# Altium project Project1_TPSM84824.PrjPcb
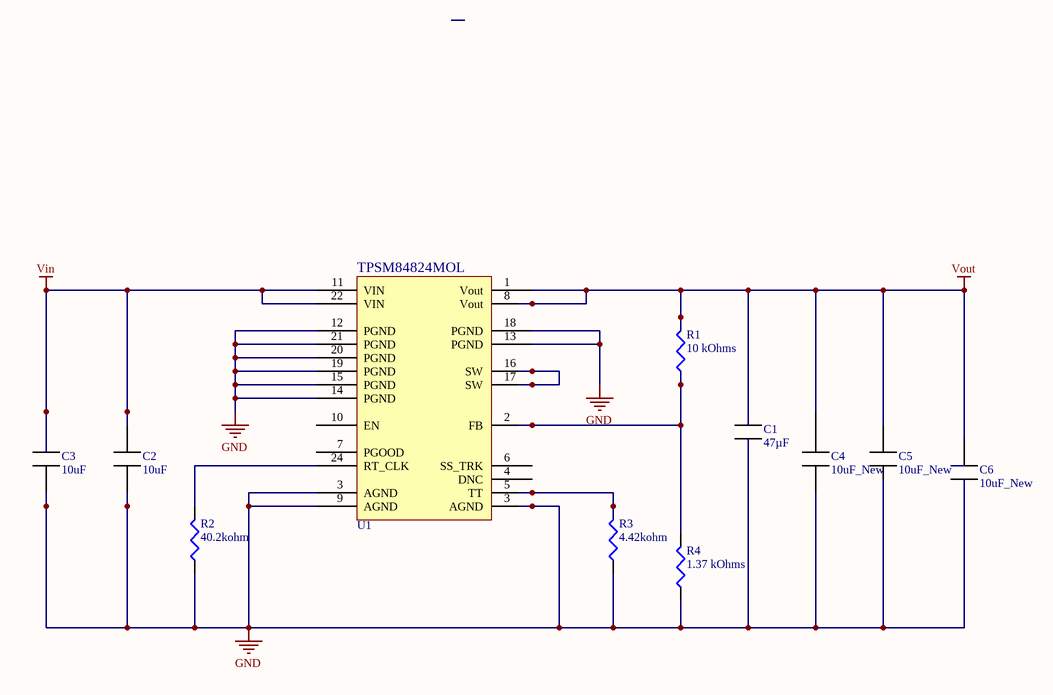
[diagram p0: TPSM84824MOL.SchDoc]
1 sheet, 11 parts. Net scope: global (net labels, ports and power ports of the same name join across sheets).
Board file: TPSM84824_PCB.PcbDoc

## Sheet TPSM84824MOL.SchDoc
size A

### Parts
C1  47µF  [C/R0805]
C2  10uF  [C/R0805]
C3  10uF  [C/R0805]
C4  10uF_New  [CAPPM7343X310N]
C5  10uF_New  [CAPPM7343X310N]
C6  10uF_New  [CAPPM7343X310N]
R1  10 kOhms  [C/R0805]
R2  40.2kohm  [C/R0805]
R3  4.42kohm  [C/R0805]
R4  1.37 kOhms  [C/R0805]
U1  TPSM84824MOL  [TPSM84424MOLR]  (value not drawn)

### Nets
GND: C1.3 C2.1 C3.1 C6.3 R2.1 R3.1 R4.1 U1.3(AGND) U1.9(AGND) U1.12(PGND) U1.13(PGND) U1.14(PGND) U1.15(PGND) U1.18(PGND) U1.19(PGND) U1.20(PGND) U1.21(PGND)
Vin: C2.2 C3.2 U1.11(VIN) U1.22(VIN)
Vout: C1.4 R1.2 U1.1(Vout) U1.8(Vout)
NetR1_1: R1.1 R4.2 U1.2(FB)
NetR2_2: R2.2 U1.24(RT_CLK)
NetR3_2: R3.2 U1.5(TT)
NetU1_16: U1.16(SW) U1.17(SW)

Not connected (* = marked no-connect by the designer): C4 3 4; C5 3 4; C6 4; U1 4(DNC) 6(SS_TRK) 7(PGOOD) 10(EN)

### Library data of the parts
C1 = GRM21BR60J476ME15K: 47µF 6.3V Ceramic Capacitor X5R 0805 (2012 Metric) 0.079" L x 0.049" W (2.00mm x 1.25mm); Manufacturer: Murata; Categories: Capacitors; Tolerance: ±20%; Supplier 1: Digi-Key; Manufacturer Part Number: GRM21BR60J476ME15K; Stock 1: 16872; Pricing 1: 1=0.48, 10=0.339, 100=0.2236, 500=0.1656, 1000=0.1408, 2500=0.1325, 5000=0.1242 (USD); Series: GRM; Packaging: Tape & Reel (TR); Part Status: Not For New Designs; Capacitance: 47µF; Voltage - Rated: 6.3V; Temperature Coefficient: X5R; Operating Temperature: -55°C ~ 85°C; Features: -; Ratings: -; Applications: General Purpose; Mounting Type: Surface Mount, MLCC; Package / Case: 0805 (2012 Metric); Size / Dimension: 0.079 L x 0.049 W (2.00mm x 1.25mm); Height - Seated (Max): -; Thickness (Max): 0.057 (1.45mm); Lead Spacing: -; Lead Style: -; ComponentLink1URL: http://www.mouser.com/ds/2/281/c02e-2905.pdf?src-supplier=Mouser; ComponentLink1Description: http://www.mouser.com/ds/2/281/c02e-2905.pdf?src-supplier=Mouser; ComponentLink2URL: https://search.murata.co.jp/Ceramy/image/img/A01X/G101/ENG/GRM21BR60J476ME15-01.pdf?src-supplier=Digi-Key; ComponentLink2Description: https://search.murata.co.jp/Ceramy/image/img/A01X/G101/ENG/GRM21BR60J476ME15-01.pdf?src-supplier=Digi-Key
C2 C3 = C0805C106K8PACTU: CAP CER 10UF 10V X5R 0805; Manufacturer: KEMET; Voltage: 10 Vdc; Tolerance: 10 %; Product Length: 2 mm; Product Height: 1.25 mm; Supplier 1: Digi-Key; Manufacturer Part Number: C0805C106K8PACTU; Stock 1: 872414; Pricing 1: 1=0.16, 10=0.117, 100=0.055, 500=0.0386, 1000=0.0319 (USD); Package/Case: 0805; Mounting: Surface Mount; Capacitance Value: 10 uF; Dielectric: X5R; Operating Temperature: -55 to 85 °C; Construction: Flat; Category: Capacitor Ceramic Multilayer; ComponentLink1URL: http://www.farnell.com/datasheets/2739827.pdf?src-supplier=Element14; ComponentLink1Description: http://www.farnell.com/datasheets/2739827.pdf?src-supplier=Element14; ComponentLink2URL: http://www.farnell.com/datasheets/40889.pdf?src-supplier=Element14; ComponentLink2Description: http://www.farnell.com/datasheets/40889.pdf?src-supplier=Element14
C4-C6 = T495D106M035ATE125: CAP TANT 10UF 35V 20% 2917; Manufacturer: KEMET; Product Range: KEMET - T495 Series; Capacitance: 10µF; Capacitor Case Style: 2917 ^7343 Metric]; ESR: 0.125ohm; Supplier 1: Digi-Key; Manufacturer Part Number: T495D106M035ATE125; Stock 1: 5675; Pricing 1: 1=1.79, 10=1.449, 100=1.1066 (USD); Packaging: Full Reel; Capacitance Tolerance: ± 20%; Voltage Rating: 35V; Operating Temperature Max: 125°C; Operating Temperature Min: -55°C; ComponentLink1URL: https://www.verical.com/server-webapp/html/getDatasheet?partID=44813&src-supplier=Verical; ComponentLink1Description: https://www.verical.com/server-webapp/html/getDatasheet?partID=44813&src-supplier=Verical; ComponentLink2URL: http://www.farnell.com/datasheets/1761160.pdf?src-supplier=Element14; ComponentLink2Description: http://www.farnell.com/datasheets/1761160.pdf?src-supplier=Element14; ComponentLink3URL: http://www.farnell.com/datasheets/1744560.pdf?src-supplier=Element14; ComponentLink3Description: http://www.farnell.com/datasheets/1744560.pdf?src-supplier=Element14
R1 = RC0805FR-0710KL: RES SMD 10K OHM 1% 1/8W 0805; Manufacturer: Yageo; Power Rating: 125 mW (1/8 W); Voltage Rating: 150 V; Temperature Coefficient: 100 PPM / C; Supplier 1: Digi-Key; Manufacturer Part Number: RC0805FR-0710KL; Stock 1: 37419702; Pricing 1: 1=0.1, 10=0.036, 100=0.0147, 1000=0.0066, 2500=0.0057 (USD); Termination Style: SMD/SMT; Product: Thick Film Resistors General Purpose; Resistance: 10 kOhms; Tolerance: 1 %; Case Code - in: 0805; Case Code - mm: 2012; Series: RC; Operating Temperature Range: - 55 C to + 155 C; Packaging: Reel; ComponentLink1URL: http://www.yageo.com/documents/recent/PYu-RC_Group_51_RoHS_L_9.pdf?src-supplier=Mouser; ComponentLink1Description: http://www.yageo.com/documents/recent/PYu-RC_Group_51_RoHS_L_9.pdf?src-supplier=Mouser; ComponentLink2URL: http://www.farnell.com/datasheets/2167052.pdf?src-supplier=Element14; ComponentLink2Description: http://www.farnell.com/datasheets/2167052.pdf?src-supplier=Element14; ComponentLink3URL: http://www.yageo.com/documents/recent/PYu-RC_Group_51_RoHS_L_10.pdf?src-supplier=Digi-Key; ComponentLink3Description: http://www.yageo.com/documents/recent/PYu-RC_Group_51_RoHS_L_10.pdf?src-supplier=Digi-Key; ComponentLink4URL: http://www.yageo.ru/pdf/RC0805.pdf?src-supplier=Future+Electronics; ComponentLink4Description: http://www.yageo.ru/pdf/RC0805.pdf?src-supplier=Future+Electronics
R2 = ERA-6AEB4022V: Res Thin Film 0805 40.2K Ohm 0.1% 1/8W 25ppm/C Molded SMD SMD Punched Carrier T/R; Manufacturer: Panasonic; Product Range: PANASONIC - ERA Series Metal Film Chip Resistor; Power Rating: 125mW; Resistor Case Style: 0805 [2012 Metric]; Temperature Coefficient: ± 25ppm/°C; Voltage Rating: 100V; External Depth: 1.25mm; External Length / Height: 0.5mm; External Width: 2mm; No. of Pins: 2; Supplier 1: Digi-Key; Manufacturer Part Number: ERA-6AEB4022V; Stock 1: 45354; Pricing 1: 1=0.36, 10=0.302, 100=0.1182, 1000=0.0495, 2500=0.0454 (USD); Resistance: 40.2kohm; Resistance Tolerance: ± 0.1%; Resistor Element Material: Thin Film; Operating Temperature Max: 155°C; Operating Temperature Min: -55°C; Operating Temperature Range: -55°C to +155°C; Packaging: Reel; Resistor Mounting: SMD; Series: ERA; ComponentLink1URL: http://uk.rs-online.com/webdocs/0eb1/0900766b80eb1d8c.pdf?src-supplier=RSComponents; ComponentLink1Description: http://uk.rs-online.com/webdocs/0eb1/0900766b80eb1d8c.pdf?src-supplier=RSComponents; ComponentLink2URL: http://industrial.panasonic.com/www-data/pdf/AOA0000/AOA0000CE26.pdf?src-supplier=Avnet+Europe; ComponentLink2Description: http://industrial.panasonic.com/www-data/pdf/AOA0000/AOA0000CE26.pdf?src-supplier=Avnet+Europe; ComponentLink3URL: http://www.farnell.com/datasheets/485442.pdf?src-supplier=Farnell; ComponentLink3Description: http://www.farnell.com/datasheets/485442.pdf?src-supplier=Farnell; ComponentLink4URL: http://www.farnell.com/datasheets/485442.pdf?src-supplier=Element14; ComponentLink4Description: http://www.farnell.com/datasheets/485442.pdf?src-supplier=Element14; ComponentLink5URL: http://www.mouser.com/ds/2/315/AOA0000CE26-32660.pdf?src-supplier=Mouser; ComponentLink5Description: http://www.mouser.com/ds/2/315/AOA0000CE26-32660.pdf?src-supplier=Mouser; ComponentLink6URL: http://industrial.panasonic.com/www-data/pdf/AOA0000/AOA0000CE26.pdf?src-supplier=Avnet; ComponentLink6Description: http://industrial.panasonic.com/www-data/pdf/AOA0000/AOA0000CE26.pdf?src-supplier=Avnet; ComponentLink7URL: https://produktinfo.conrad.com/datenblaetter/450000-474999/458496-da-01-en-WIDERSTAND_0805_ERA.pdf?src-supplier=Conrad; ComponentLink7Description: https://produktinfo.conrad.com/datenblaetter/450000-474999/458496-da-01-en-WIDERSTAND_0805_ERA.pdf?src-supplier=Conrad
R3 = ERA-6AEB4421V: Panasonic ERA Series Thin Film Surface Mount Fixed Resistor 0805 Case 4.42k 0.1% 0.125W 25ppm/C; Power Rating: 125mW; Resistor Case Style: 0805 [2012 Metric]; Temperature Coefficient: ± 25ppm/°C; Voltage Rating: 100V; External Depth: 1.25mm; External Length / Height: 0.5mm; External Width: 2mm; No. of Pins: 2; Product Range: PANASONIC - ERA; Resistor Mounting: SMD; Supplier 1: Digi-Key; Manufacturer: Panasonic; Manufacturer Part Number: ERA-6AEB4421V; Stock 1: 10445; Pricing 1: 1=0.36, 10=0.302, 100=0.1182, 1000=0.0495, 2500=0.0454 (USD); Resistance: 4.42kohm; Resistance Tolerance: ± 0.1%; Resistor Element Material: Thin Film; Operating Temperature Max: 155°C; Operating Temperature Min: -55°C; Operating Temperature Range: -55°C to +155°C; Packaging: Reel; Series: ERA; ComponentLink1URL: http://uk.rs-online.com/webdocs/0eb1/0900766b80eb1d8c.pdf?src-supplier=RSComponents; ComponentLink1Description: http://uk.rs-online.com/webdocs/0eb1/0900766b80eb1d8c.pdf?src-supplier=RSComponents; ComponentLink2URL: http://www.farnell.com/datasheets/485442.pdf?src-supplier=Farnell; ComponentLink2Description: http://www.farnell.com/datasheets/485442.pdf?src-supplier=Farnell; ComponentLink3URL: http://www.farnell.com/datasheets/485442.pdf?src-supplier=Element14; ComponentLink3Description: http://www.farnell.com/datasheets/485442.pdf?src-supplier=Element14; ComponentLink4URL: http://industrial.panasonic.com/www-data/pdf/AOA0000/AOA0000CE26.pdf?src-supplier=Avnet; ComponentLink4Description: http://industrial.panasonic.com/www-data/pdf/AOA0000/AOA0000CE26.pdf?src-supplier=Avnet; ComponentLink5URL: http://www.produktinfo.conrad.com/datenblaetter/1100000-1199999/001181285-da-01-en-WIDERSTAND_ERA_0805_4K42_0_1__5000ST.pdf?src-supplier=Conrad; ComponentLink5Description: http://www.produktinfo.conrad.com/datenblaetter/1100000-1199999/001181285-da-01-en-WIDERSTAND_ERA_0805_4K42_0_1__5000ST.pdf?src-supplier=Conrad
R4 = RC0805FR-071K37L: RES SMD 1.37K OHM 1% 1/16W 0402; Manufacturer: Vishay; Manufacturer Part Number: CRCW04021K37FKED; Brand: Vishay / Dale; Power Rating: 63 mW; Temperature Coefficient: 100 PPM / K; Voltage Rating: 50 V; Unit Weight: 0.000023 oz; Supplier 1: Digi-Key; Stock 1: 47266; Pricing 1: 1=0.1, 10=0.038, 100=0.0154, 1000=0.0069, 2500=0.006, 5000=0.005 (USD); Product Category: Thick Film Resistors - SMD; RoHS: Details; Resistance: 1.37 kOhms; Tolerance: 1 %; Case Code - in: 0402; Case Code - mm: 1005; Operating Temperature Range: - 55 C to + 155 C; Series: CRCW; Height: 0.35 mm; Length: 1 mm; Package / Case: 0402 (1005 metric); Packaging: Reel; Product: Thick Film Resistors SMD; Factory Pack Quantity: 10000; Termination Style: SMD/SMT; Width: 0.5 mm; ComponentLink1URL: http://www.vishay.com/docs/20035/dcrcwe3.pdf?src-supplier=Digi-Key; ComponentLink1Description: http://www.vishay.com/docs/20035/dcrcwe3.pdf?src-supplier=Digi-Key; ComponentLink2URL: http://www.vishay.com/docs/20035/dcrcwe3.pdf?src-supplier=Avnet; ComponentLink2Description: http://www.vishay.com/docs/20035/dcrcwe3.pdf?src-supplier=Avnet; ComponentLink3URL: http://www.farnell.com/datasheets/1697337.pdf?src-supplier=Element14; ComponentLink3Description: http://www.farnell.com/datasheets/1697337.pdf?src-supplier=Element14; ComponentLink4URL: http://www.farnell.com/datasheets/2310790.pdf?src-supplier=Farnell; ComponentLink4Description: http://www.farnell.com/datasheets/2310790.pdf?src-supplier=Farnell; ComponentLink5URL: http://www.mouser.com/ds/2/427/dcrcwe3-109170.pdf?src-supplier=Mouser; ComponentLink5Description: http://www.mouser.com/ds/2/427/dcrcwe3-109170.pdf?src-supplier=Mouser; ComponentLink6URL: http://www.farnell.com/datasheets/2111203.pdf?src-supplier=Element14; ComponentLink6Description: http://www.farnell.com/datasheets/2111203.pdf?src-supplier=Element14; ComponentLink7URL: http://www.vishay.com/docs/20035/dcrcwe3.pdf?src-supplier=Future+Electronics; ComponentLink7Description: http://www.vishay.com/docs/20035/dcrcwe3.pdf?src-supplier=Future+Electronics; ComponentLink8URL: http://www.farnell.com/datasheets/2045674.pdf?src-supplier=Element14; ComponentLink8Description: http://www.farnell.com/datasheets/2045674.pdf?src-supplier=Element14; ComponentLink9URL: https://www.alliedelec.com/m/d/0c934d6939ccefa68dbe0b96d821c8cf.pdf?src-supplier=Allied+Electronics; ComponentLink9Description: https://www.alliedelec.com/m/d/0c934d6939ccefa68dbe0b96d821c8cf.pdf?src-supplier=Allied+Electronics
U1 = TPSM84824MOL: DC DC CONVERTER 0.6-10V; Manufacturer: Texas Instruments; Manufacturer Part Number: TPSM84824MOLR; Categories: Power Supplies - Board Mount; Number of Outputs: 1; Voltage - Input (Min): 4.5V; Voltage - Input (Max): 17V; Voltage - Output 1: 0.6 ~ 10 V; Current - Output (Max): 8A; Efficiency: 94%; Supplier 1: Digi-Key; Stock 1: 469; Pricing 1: 1=11.33, 10=10.409, 100=8.3593 (USD); Series: -; Packaging: Cut Tape (CT); Part Status: Active; Type: Non-Isolated PoL Module; Voltage - Output 2: -; Voltage - Output 3: -; Voltage - Output 4: -; Applications: ITE (Commercial); Features: OCP, OTP, UVLO; Operating Temperature: -40°C ~ 105°C; Mounting Type: Surface Mount; Package / Case: 24-SMD Module; Size / Dimension: 0.30 L x 0.30 W x 0.21 H (7.5mm x 7.5mm x 5.4mm); Supplier Device Package: 24-QFM (7.5x7.5); ComponentLink1URL: http://www.ti.com/lit/ds/symlink/tpsm84824.pdf?src-supplier=Digi-Key; ComponentLink1Description: http://www.ti.com/lit/ds/symlink/tpsm84824.pdf?src-supplier=Digi-Key